# EAGLE schematic ADC_AD7761BSTZ (EAGLE 9.5.2)
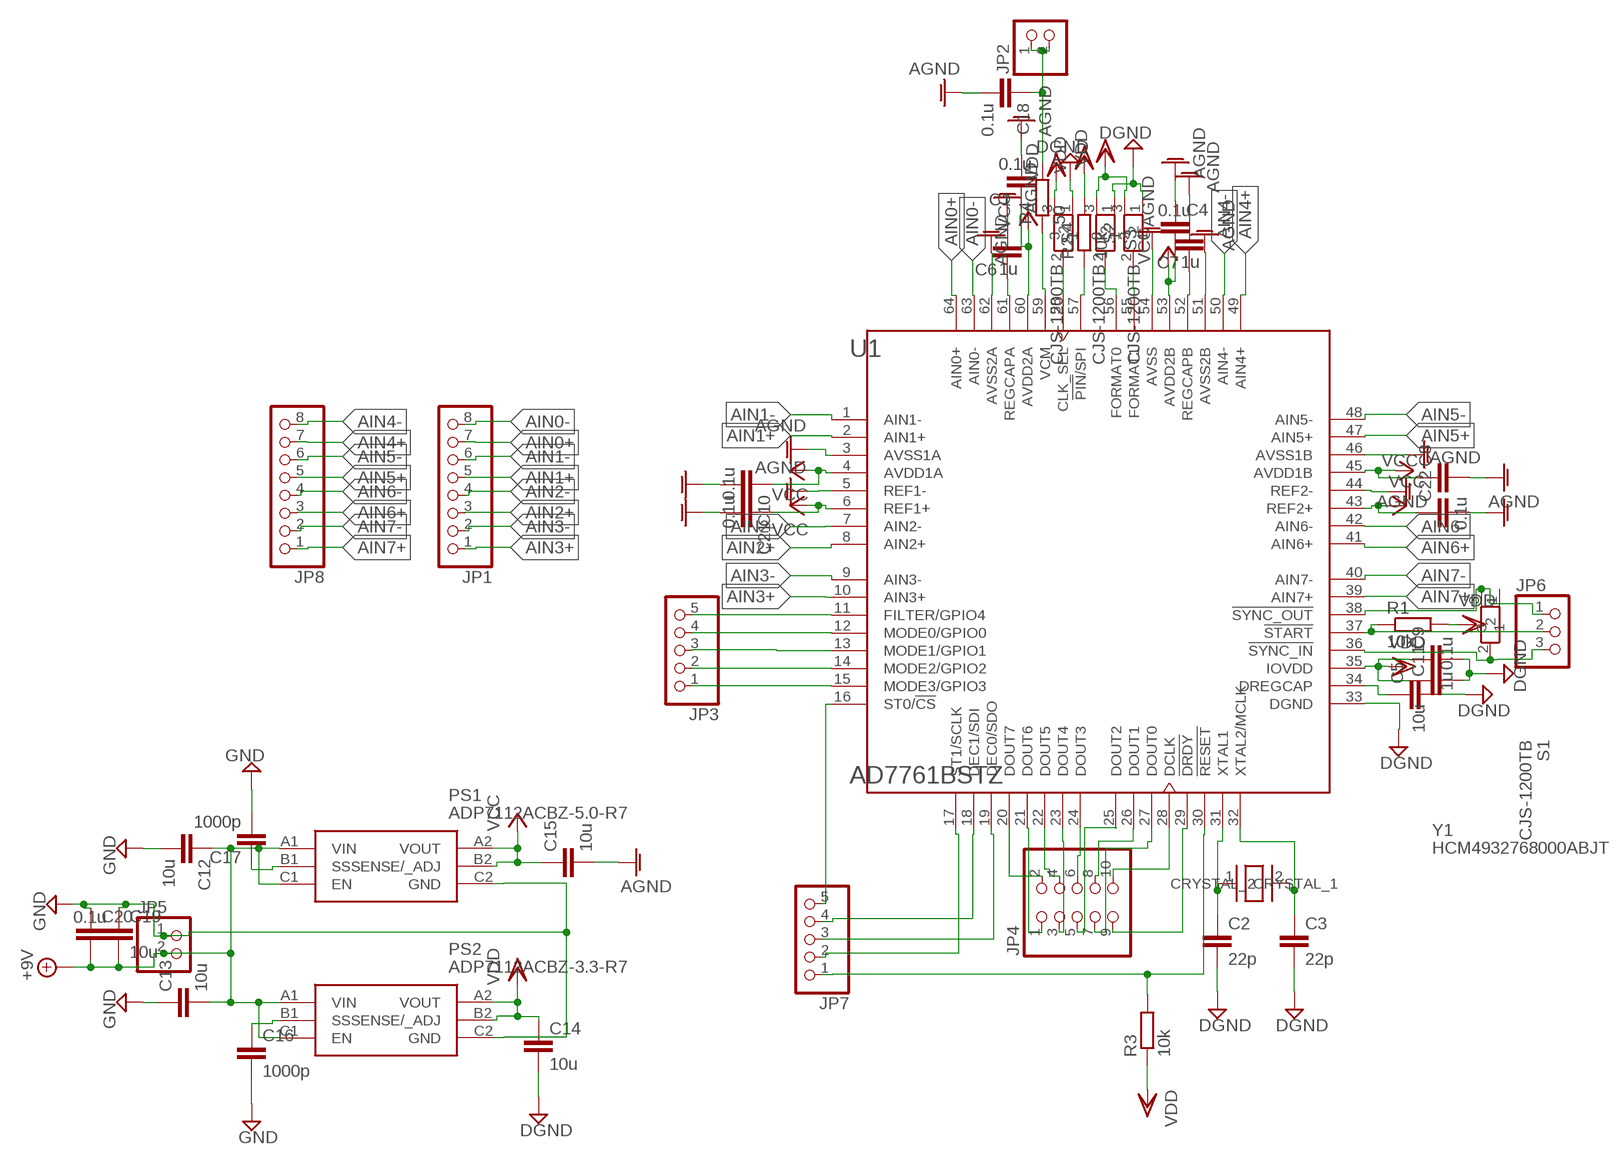
[diagram p0: schematic, sheet 1]

## Parts
C1  0.1u  C-EUC1608  [C1608]
C2  22p  C-EUC1608  [C1608]
C3  22p  C-EUC1608  [C1608]
C4  0.1u  C-EUC1608  [C1608]
C5  10u  C-EUC2012  [C2012]
C6  1u  C-EUC1608  [C1608]
C7  1u  C-EUC1608  [C1608]
C8  0.1u  C-EUC1608  [C1608]
C9  0.1u  C-EUC1608  [C1608]
C10  0.1u  C-EUC1608  [C1608]
C11  1u  C-EUC1608  [C1608]
C12  10u  C-EUC2012  [C2012]
C13  10u  C-EUC2012  [C2012]
C14  10u  C-EUC2012  [C2012]
C15  10u  C-EUC2012  [C2012]
C16  1000p  C-EUC1608  [C1608]
C17  1000p  C-EUC1608  [C1608]
C18  0.1u  C-EUC1608  [C1608]
C19  10u  C-EUC2012  [C2012]
C20  0.1u  C-EUC1608  [C1608]
C21  0.1u  C-EUC1608  [C1608]
C22  0.1u  C-EUC1608  [C1608]
JP1  PINHD-1X8  [1X08]
JP2  PINHD-1X2  [1X02]
JP3  PINHD-1X5  [1X05]
JP4  PINHD-2X5  [2X05]
JP5  PINHD-1X2  [1X02]
JP6  PINHD-1X3  [1X03]
JP7  PINHD-1X5  [1X05]
JP8  PINHD-1X8  [1X08]
PS1  ADP7112ACBZ-5.0-R7  ADP7112ACBZ-3.3-R7  [BGA6C40P2X3_95X116X56]
PS2  ADP7112ACBZ-3.3-R7  [BGA6C40P2X3_95X116X56]
R1  10k  R-EU_R0603  [R0603]
R2  10k  R-EU_R0603  [R0603]
R3  10k  R-EU_R0603  [R0603]
R4  50  R-EU_R0603  [R0603]
S1  CJS-1200TB  [B-TYPE]
S2  CJS-1200TB  [B-TYPE]
S3  CJS-1200TB  [B-TYPE]
S4  CJS-1200TB  [B-TYPE]
U1  AD7761BSTZ  [QFP50P1200X1200X160-64N]
Y1  HCM4932768000ABJT  [HCM4932768000ABJT]

## Nets
+9V: C12.1 C13.2 C19.2 C20.2 JP5.2 PS1.A1(VIN) PS1.C1(EN) PS2.A1(VIN) PS2.C1(EN)
AGND: C1.2 C4.1 C6.2 C7.2 C8.2 C10.2 C15.2 C18.2 C21.2 C22.2 U1.3(AVSS1A) U1.5(REF1-) U1.44(REF2-) U1.46(AVSS1B) U1.51(AVSS2B) U1.54(AVSS) U1.62(AVSS2A)
AIN0+: JP1.7 U1.64(AIN0+)
AIN0-: JP1.8 U1.63(AIN0-)
AIN1+: JP1.5 U1.2(AIN1+)
AIN1-: JP1.6 U1.1(AIN1-)
AIN2+: JP1.3 U1.8(AIN2+)
AIN2-: JP1.4 U1.7(AIN2-)
AIN3+: JP1.1 U1.10(AIN3+)
AIN3-: JP1.2 U1.9(AIN3-)
AIN4+: JP8.7 U1.49(AIN4+)
AIN4-: JP8.8 U1.50(AIN4-)
AIN5+: JP8.5 U1.47(AIN5+)
AIN5-: JP8.6 U1.48(AIN5-)
AIN6+: JP8.3 U1.41(AIN6+)
AIN6-: JP8.4 U1.42(AIN6-)
AIN7+: JP8.1 U1.39(AIN7+)
AIN7-: JP8.2 U1.40(AIN7-)
DGND: C2.2 C3.2 C5.2 C9.2 C11.2 C14.2 S2.1 S3.1 S4.1 U1.33(DGND)
GND: C12.2 C13.1 C16.2 C17.2 C19.1 C20.1 JP5.1 PS1.C2(GND) PS2.C2(GND)
N$1: JP7.4 U1.18(DEC1/SDI)
N$2: JP7.3 U1.19(DEC0/SDO)
N$3: JP7.5 U1.16(ST0/!CS)
N$4: JP7.2 U1.17(ST1/SCLK)
N$5: C2.1 U1.31(XTAL1) Y1.1(CRYSTAL_1)
N$6: JP6.2 R1.1 U1.37(!START)
N$7: C3.1 U1.32(XTAL2/MCLK) Y1.2(CRYSTAL_2)
N$8: JP3.5 U1.11(FILTER/GPIO4)
N$9: JP3.4 U1.12(MODE0/GPIO0)
N$10: JP3.3 U1.13(MODE1/GPIO1)
N$11: JP3.2 U1.14(MODE2/GPIO2)
N$12: JP3.1 U1.15(MODE3/GPIO3)
N$13: C16.1 PS2.B1(SS)
N$14: C7.1 U1.52(REGCAPB)
N$15: JP4.2 U1.20(DOUT7)
N$16: JP4.1 U1.21(DOUT6)
N$17: JP4.4 U1.22(DOUT5)
N$18: JP4.3 U1.23(DOUT4)
N$19: JP4.6 U1.24(DOUT3)
N$20: JP4.5 U1.25(DOUT2)
N$21: JP4.8 U1.26(DOUT1)
N$22: JP4.7 U1.27(DOUT0)
N$23: JP4.10 U1.28(DCLK)
N$24: JP4.9 U1.29(!DRDY)
N$25: C5.1 U1.34(DREGCAP)
N$26: R2.1 U1.57(!PIN!/SPI)
N$27: C6.1 U1.61(REGCAPA)
N$28: JP6.3 S1.2 U1.36(!SYNC_IN)
N$29: S4.2 U1.58(CLK_SEL)
N$30: JP6.1 S1.3 U1.38(!SYNC_OUT)
N$31: S2.2 U1.56(FORMAT0)
N$32: S3.2 U1.55(FORMAT1)
N$33: R4.1 U1.59(VCM)
N$34: C17.1 PS1.B1(SS)
N$35: JP7.1 R3.2 U1.30(!RESET)
N$36: C18.1 JP2.1 JP2.2 R4.2
VCC: C1.1 C4.2 C8.1 C10.1 C15.1 C21.1 C22.1 PS1.A2(VOUT) PS1.B2(SENSE/_ADJ) U1.4(AVDD1A) U1.6(REF1+) U1.43(REF2+) U1.45(AVDD1B) U1.53(AVDD2B) U1.60(AVDD2A)
VDD: C9.1 C11.1 C14.1 PS2.A2(VOUT) PS2.B2(SENSE/_ADJ) R1.2 R2.2 R3.1 S2.3 S3.3 S4.3 U1.35(IOVDD)
Unconnected: S1.1

## Library data of the parts
C1-C22 = rcl:C-EU: CAPACITOR, European symbol; SPICEPREFIX: C
JP1 JP8 = pinhead:PINHD-1X8: PIN HEADER
JP2 JP5 = pinhead:PINHD-1X2: PIN HEADER
JP3 JP7 = pinhead:PINHD-1X5: PIN HEADER
JP4 = pinhead:PINHD-2X5: PIN HEADER
JP6 = pinhead:PINHD-1X3: PIN HEADER
PS1 PS2 = ADP7112ACBZ-3.3-R7:ADP7112ACBZ-3.3-R7: LDO Voltage Regulators 20V 200mA LDO 3.3Vo Source: Datasheet <https://www.analog.com/media/en/technical-documentation/data-sheets/ADP7112.pdf>; ARROW_PART_NUMBER: ADP7112ACBZ-3.3-R7; DESCRIPTION: LDO Voltage Regulators 20V 200mA LDO 3.3Vo; HEIGHT: 0.56mm; MANUFACTURER_NAME: Linear Technology; MANUFACTURER_PART_NUMBER: ADP7112ACBZ-3.3-R7; MOUSER_PART_NUMBER: 584-ADP7112ACBZ3.3R7; MOUSER_PRICE-STOCK: https://www.mouser.com/Search/Refine.aspx?Keyword=584-ADP7112ACBZ3.3R7
R1-R4 = rcl:R-EU_: RESISTOR, European symbol; SPICEPREFIX: R
S1-S4 = CJS-1200TB:CJS-1200TB: SMD Slide Switch, 1-Pole (SPDT) Source: Datasheet <http://www.nidec-copal-electronics.com/e/catalog/switch/cjs.pdf>; ARROW_PART_NUMBER: CJS-1200TB; DESCRIPTION: SMD Slide Switch, 1-Pole (SPDT); HEIGHT: mm; MANUFACTURER_NAME: Copal Electronics; MANUFACTURER_PART_NUMBER: CJS-1200TB
U1 = AD7761BSTZ:AD7761BSTZ: 16 Bit Analog to Digital Converter 8 Input 8 Sigma-Delta 64-LQFP (10x10); ARROW_ELECTRONICS-PURCHASE-URL: https://snapeda.com/shop?store=Arrow+Electronics&id=598466; DESCRIPTION: 16 Bit Analog to Digital Converter 8 Input 8 Sigma-Delta 64-LQFP (10x10); DIGIKEY-PURCHASE-URL: https://snapeda.com/shop?store=DigiKey&id=598466; MF: Analog Devices; MOUSER-PURCHASE-URL: https://snapeda.com/shop?store=Mouser&id=598466; MP: AD7761BSTZ; PACKAGE: LQFP -64 Analog Devices
Y1 = HCM49:HCM4932768000ABJT: Crystals 32.768MHz 18pF Source: Datasheet <https://componentsearchengine.com/Datasheets/1/HCM4932768000ABJT.pdf>; DESCRIPTION: Crystals 32.768MHz 18pF; HEIGHT: 4.3mm; MANUFACTURER_NAME: Citizen Finetech Miyota; MANUFACTURER_PART_NUMBER: HCM4932768000ABJT; MOUSER_PART_NUMBER: 695-HCM49-327-U; MOUSER_PRICE-STOCK: https://www.mouser.com/Search/Refine.aspx?Keyword=695-HCM49-327-U